# EAGLE schematic DAWA-MAIN-7.0 (EAGLE 9.5.0)
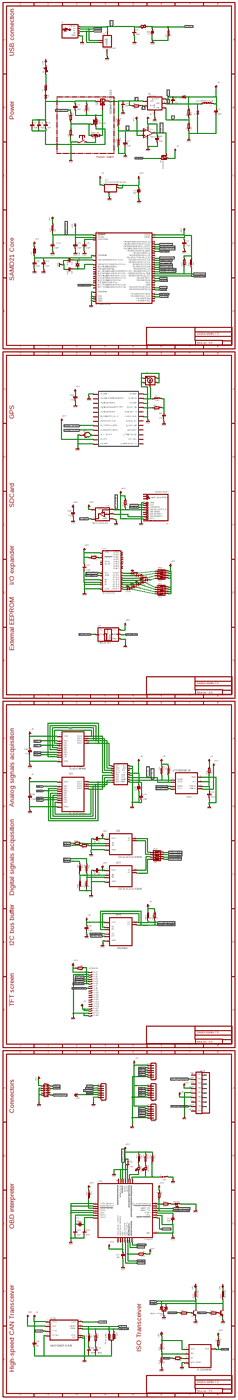
[diagram p0: schematic, sheet 1, overview]
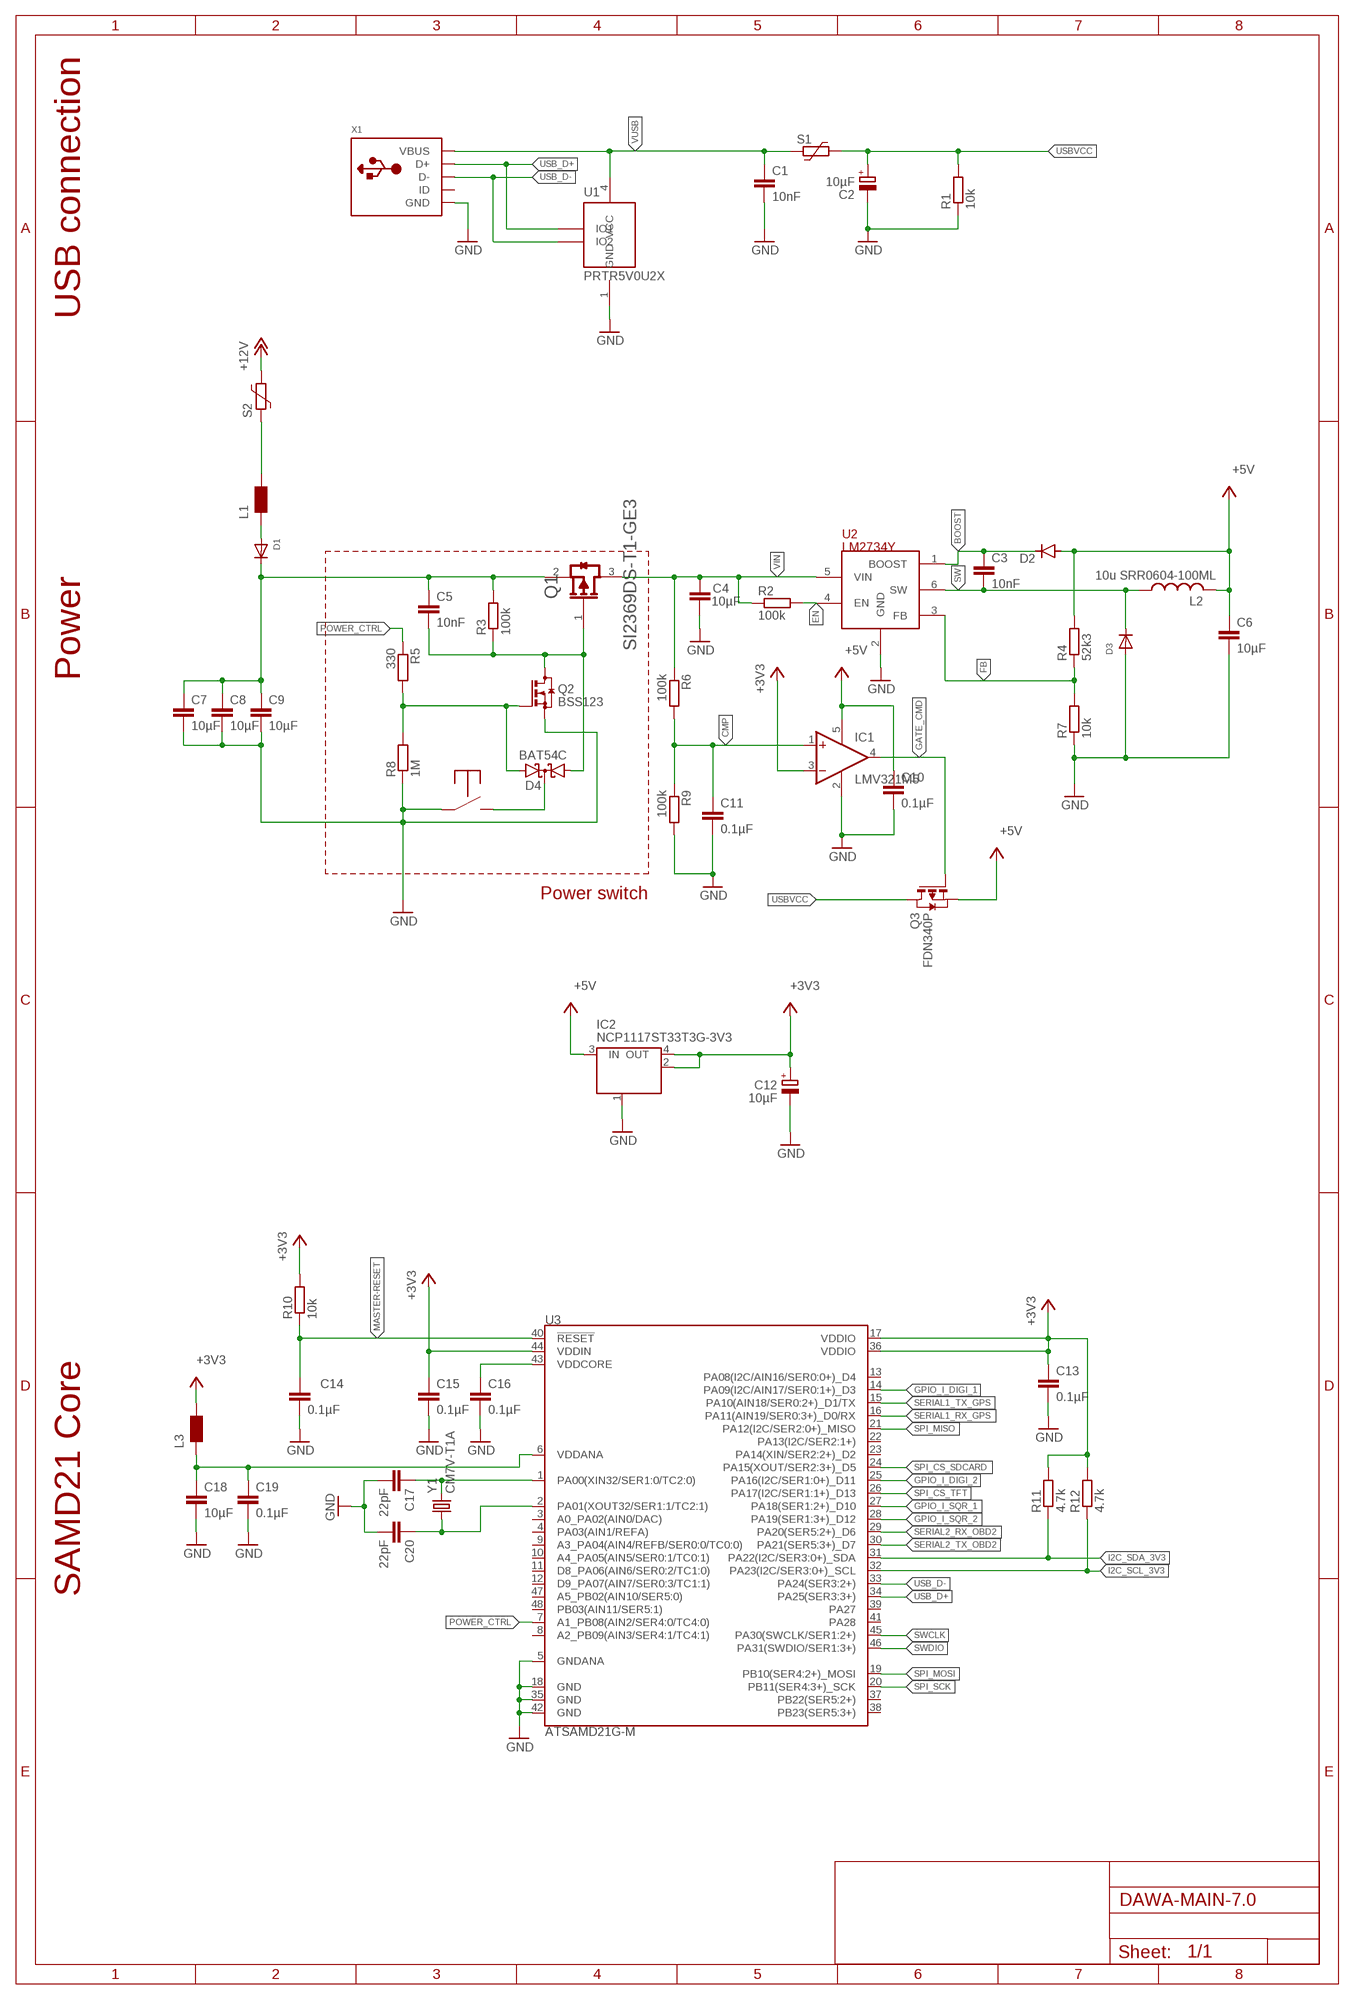
[diagram p1: schematic, sheet 1, part 1 of 4]
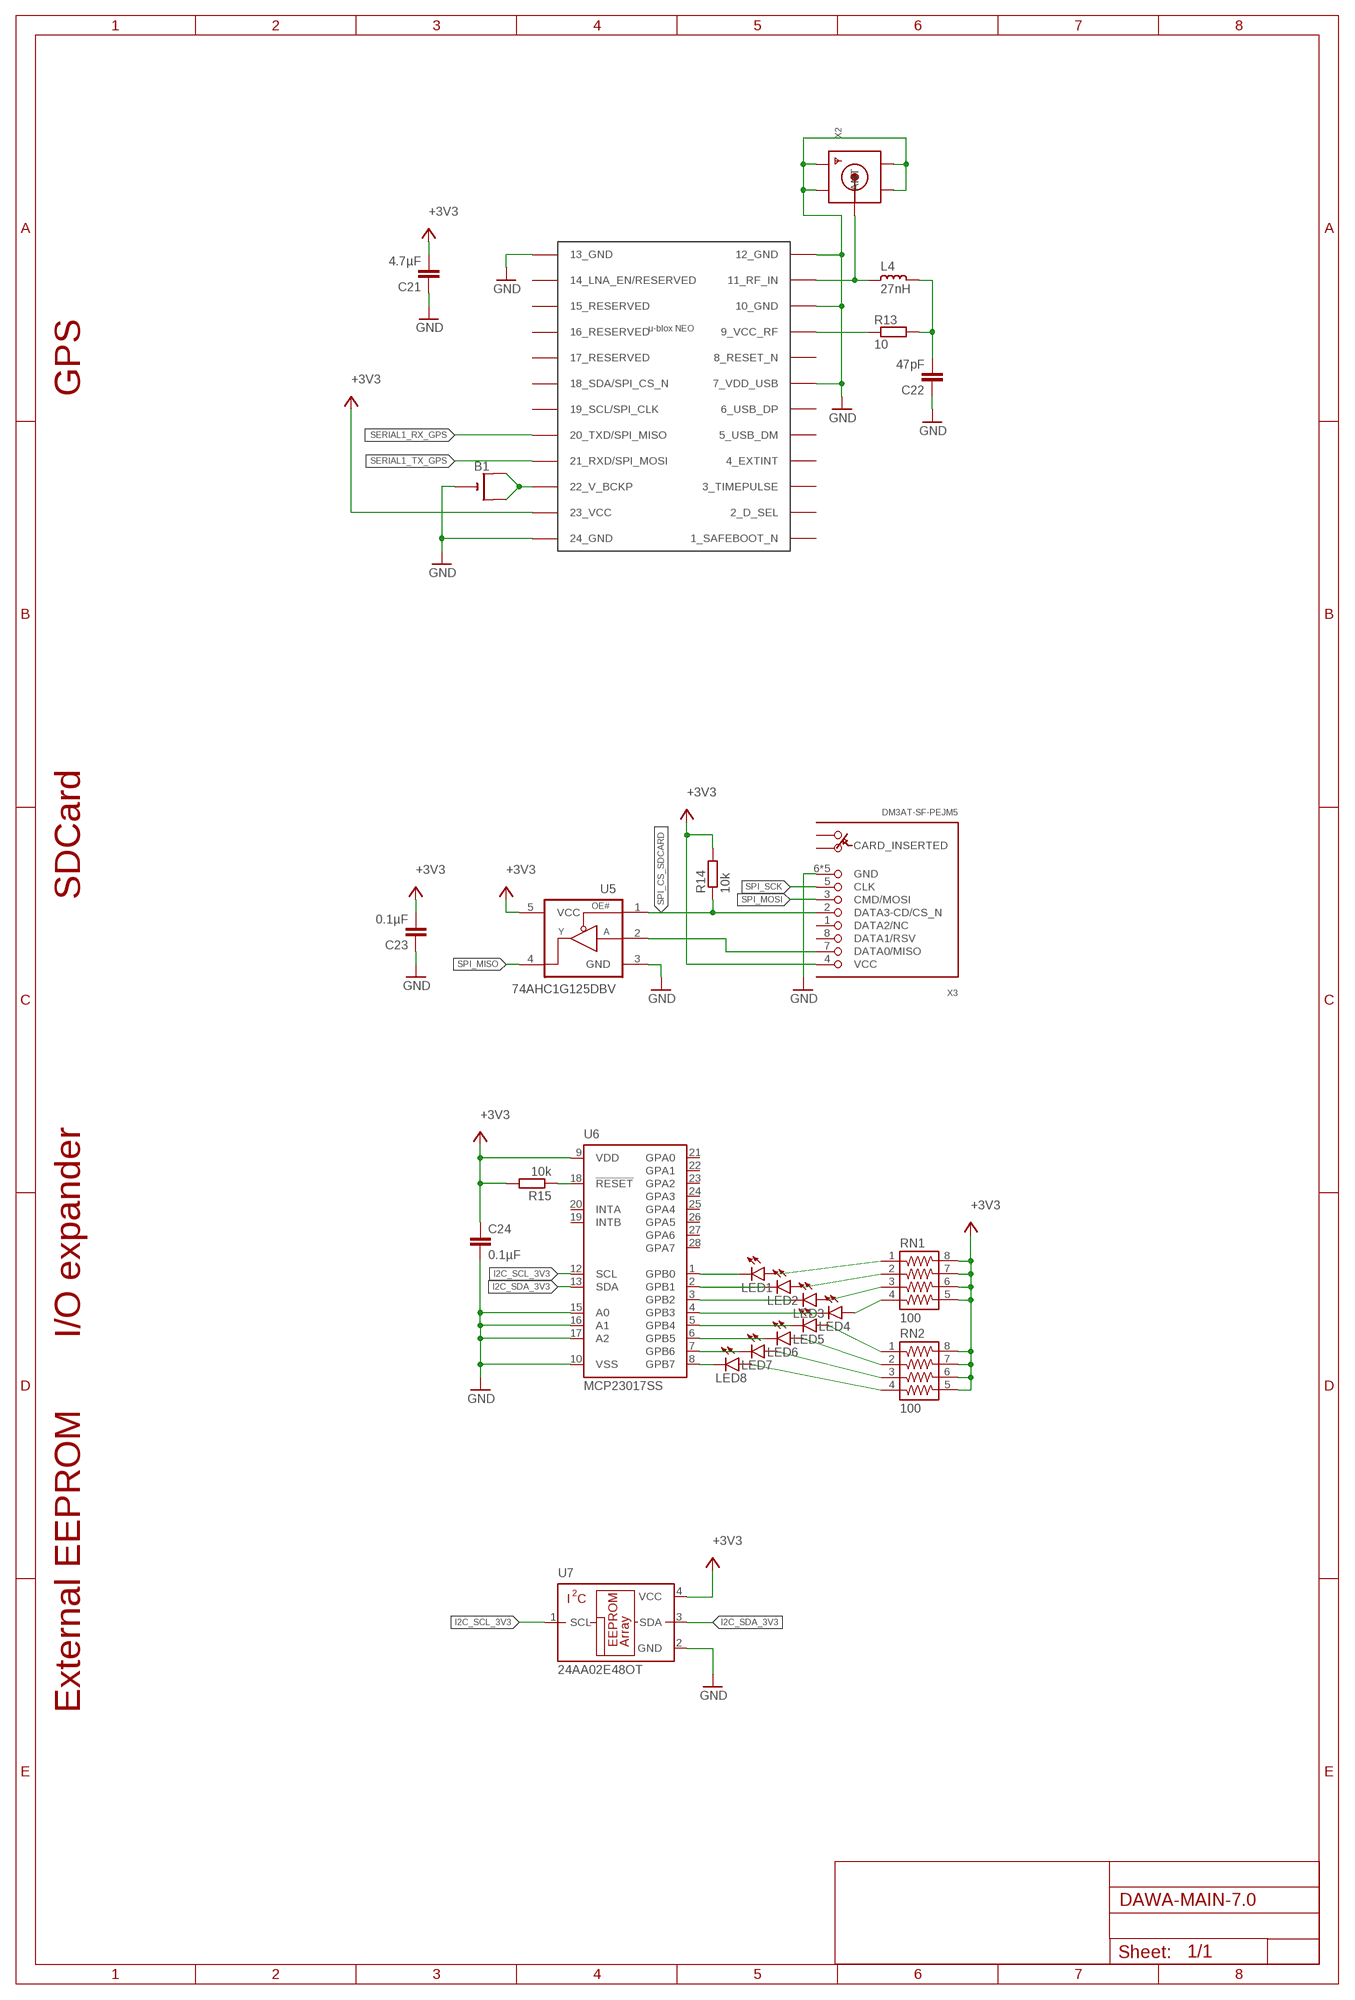
[diagram p2: schematic, sheet 1, part 2 of 4]
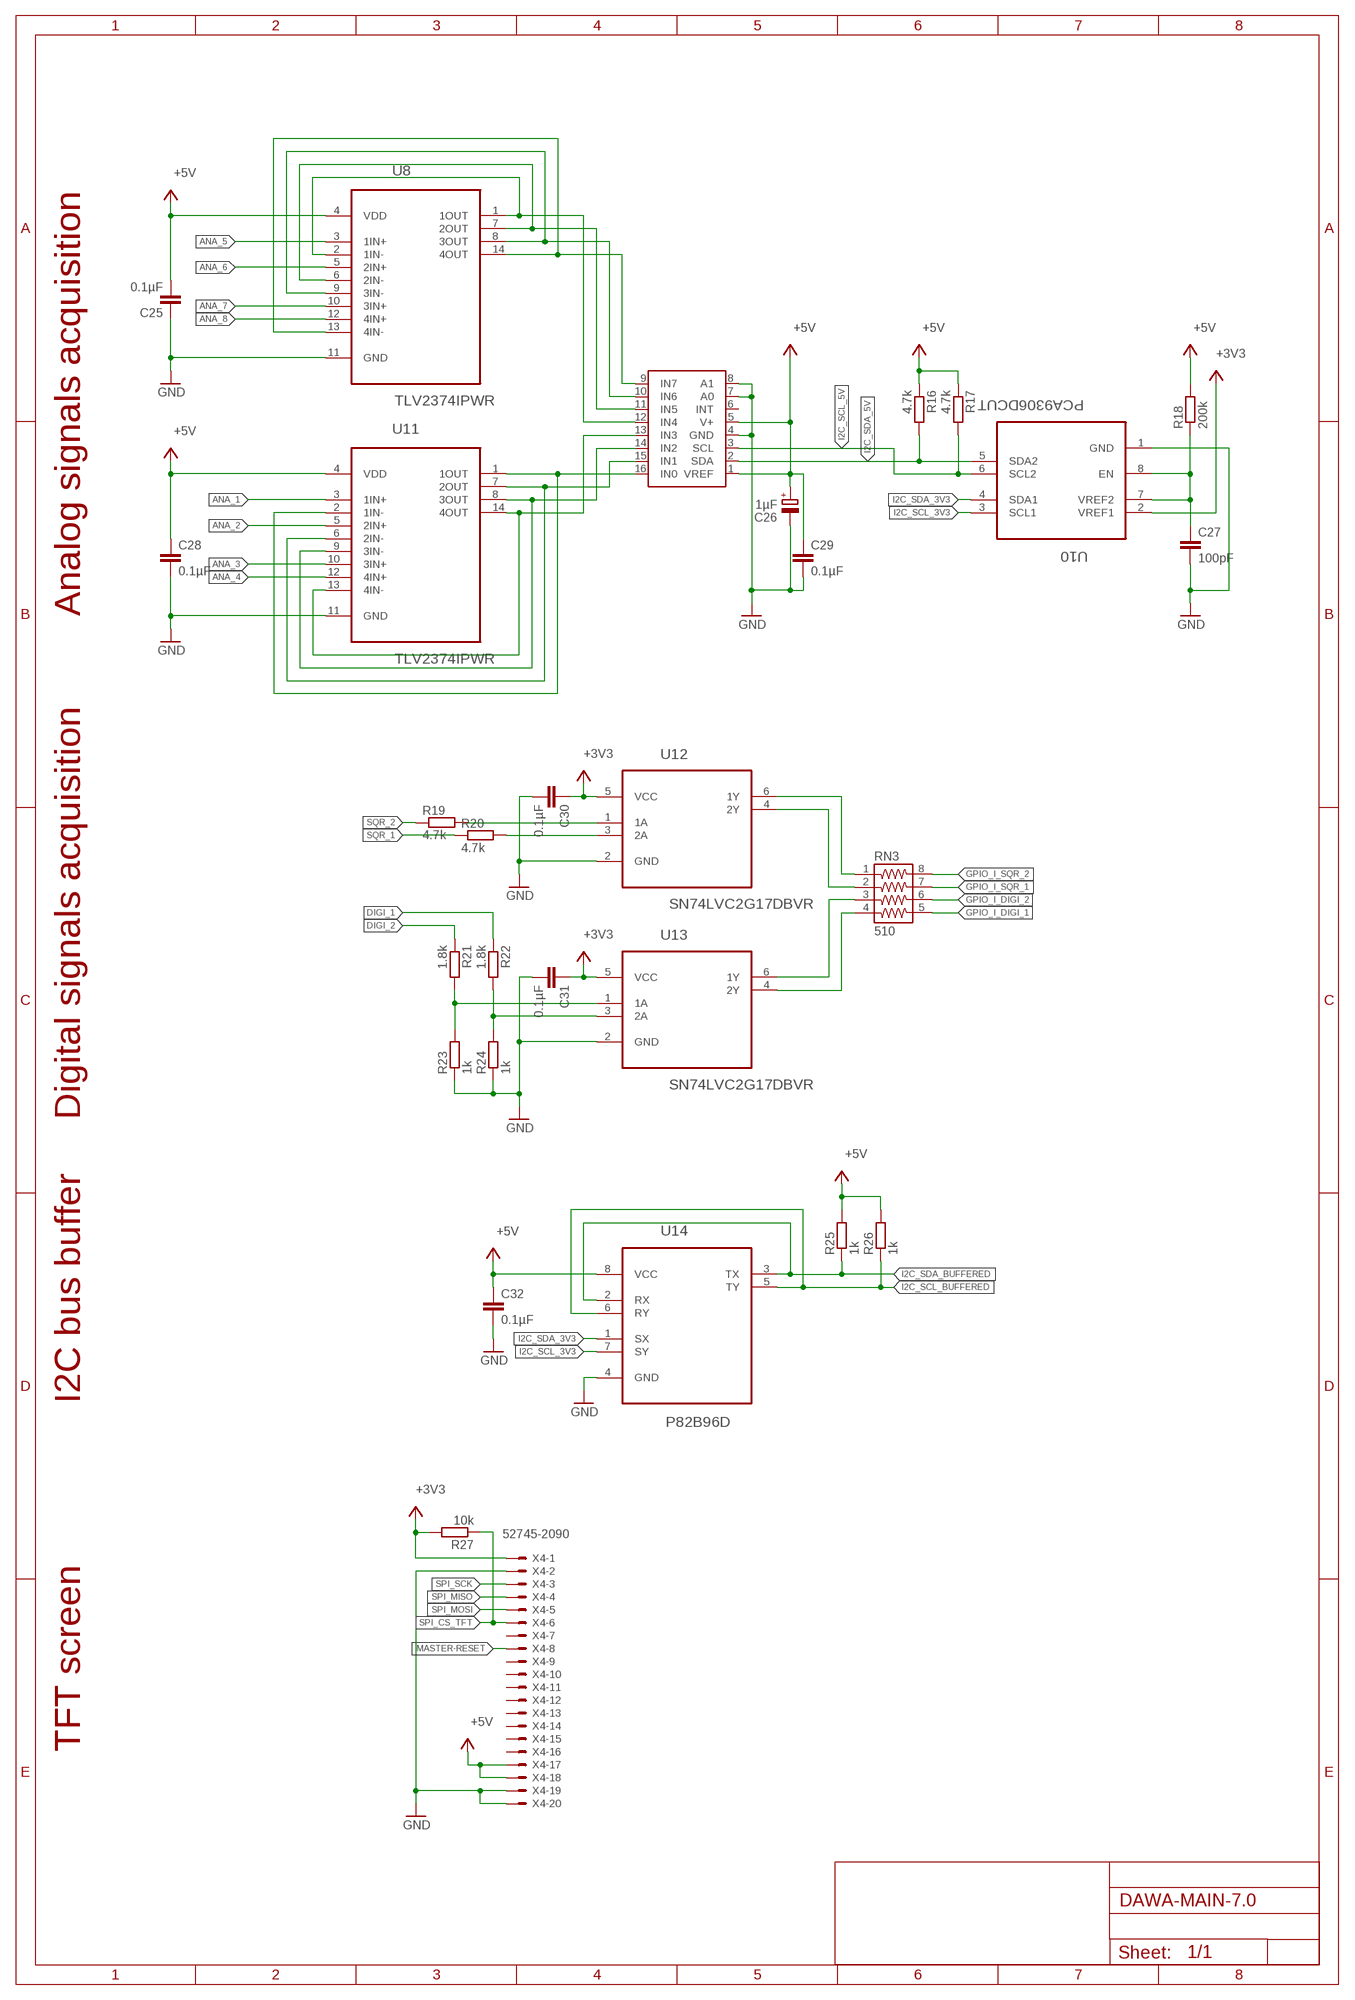
[diagram p3: schematic, sheet 1, part 3 of 4]
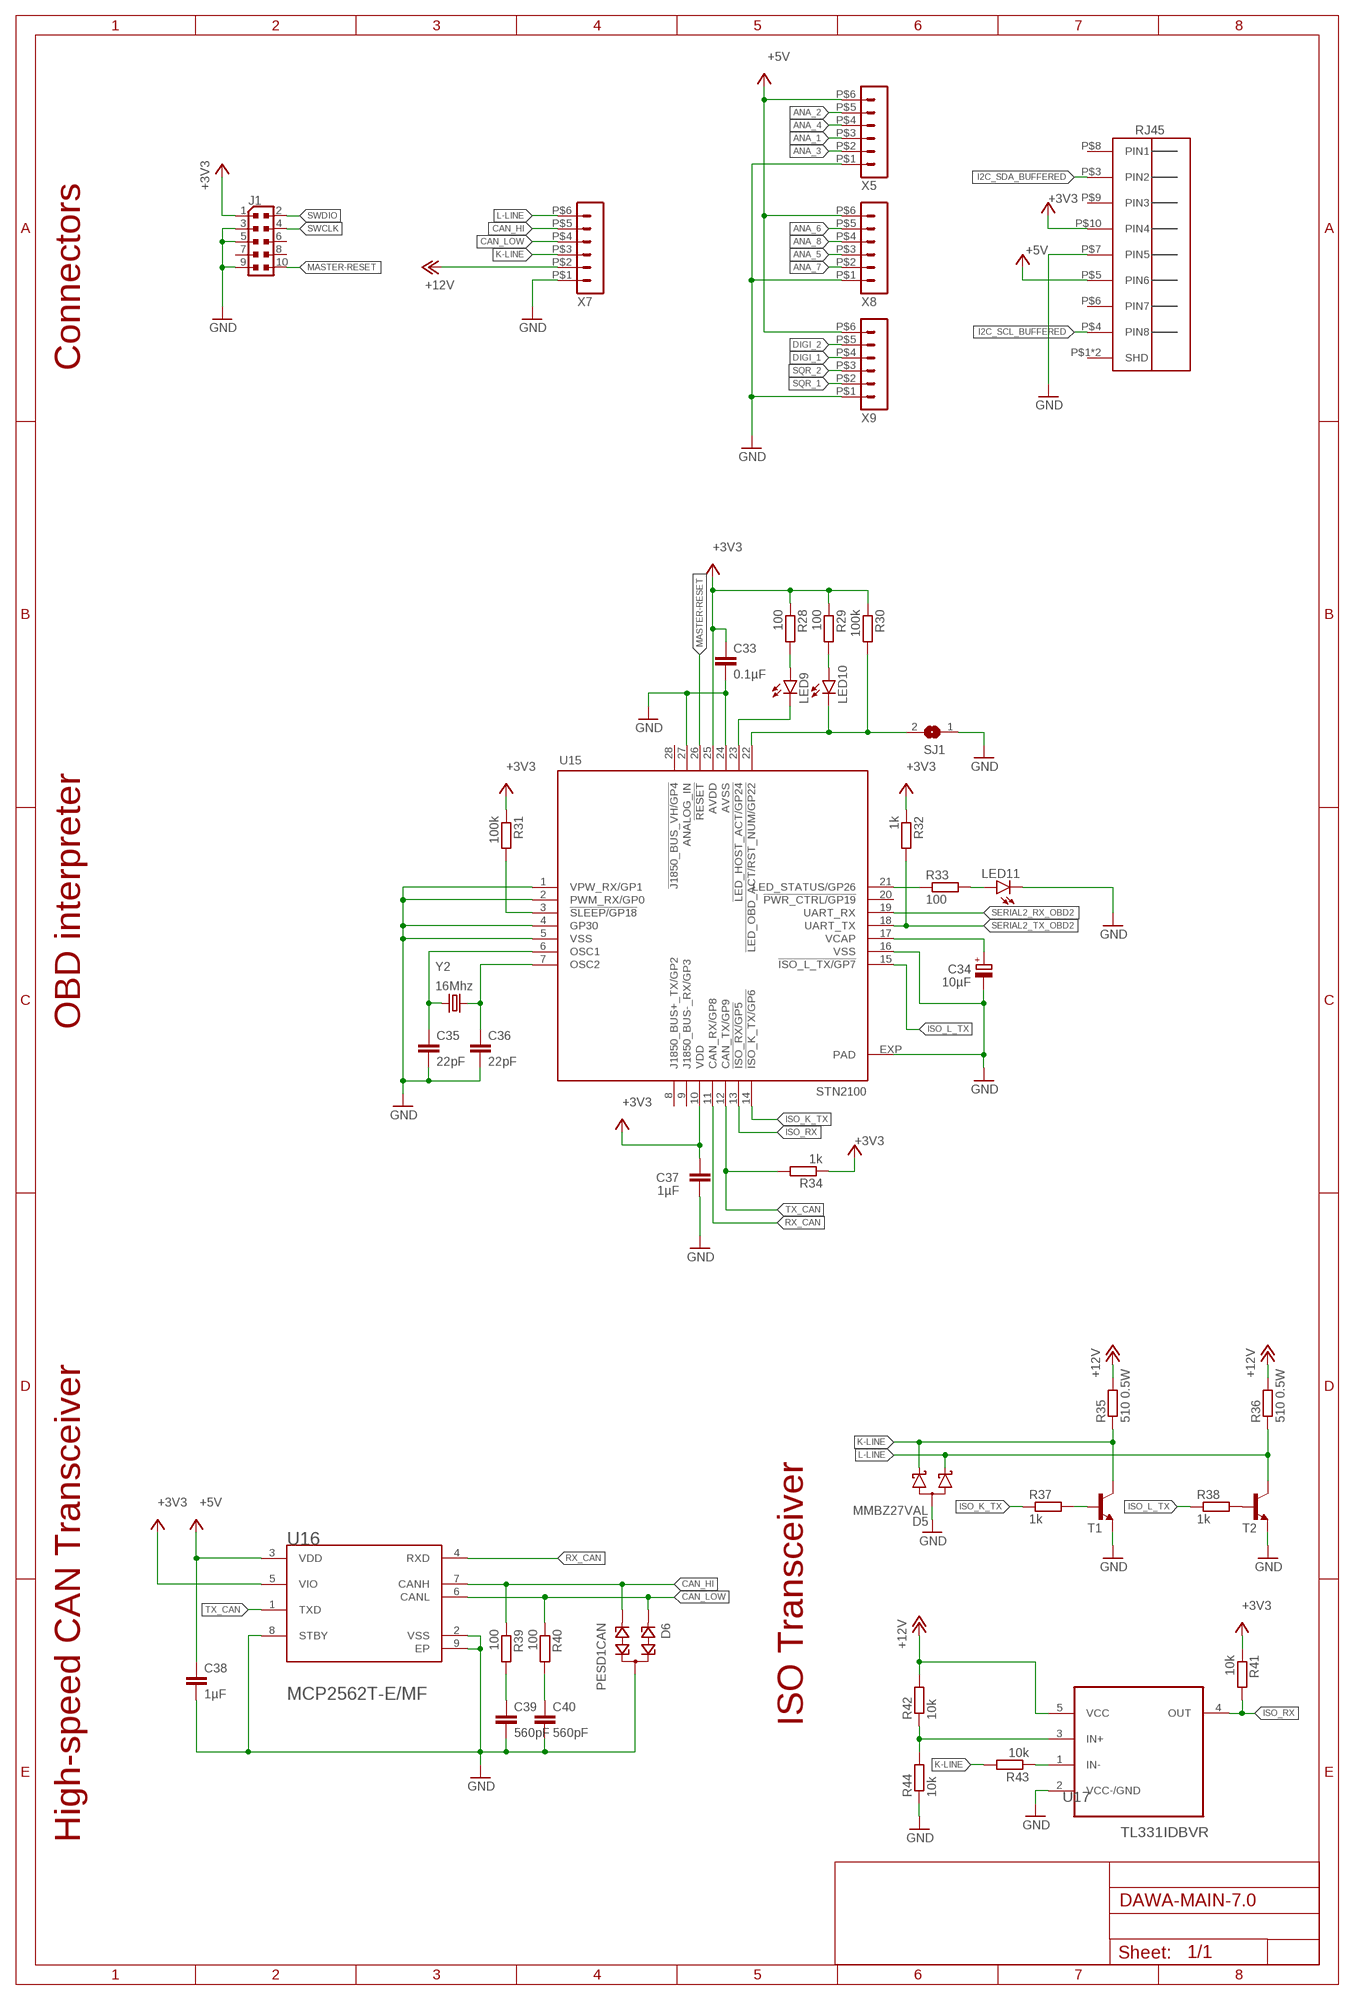
[diagram p4: schematic, sheet 1, part 4 of 4]

## Parts
B1  CR1220SMT  [CR1220-SMD]
C1  10nF  C-EU-10NF-C0603  [C0603]
C2  10µF  CPOL-EU-10UF-SMCB  [SMC_B]
C3  10nF  C-EU-10NF-C0603  [C0603]
C4  10µF  C-EU-10UF-C0805  [C0805]
C5  10nF  C-EU-10NF-C0603  [C0603]
C6  10µF  C-EU-10UF-C0805  [C0805]
C7  10µF  C-EU-10UF-C0805  [C0805]
C8  10µF  C-EU-10UF-C0805  [C0805]
C9  10µF  C-EU-10UF-C0805  [C0805]
C10  0.1µF  C-EU-0.1UF-C0603  [C0603]
C11  0.1µF  C-EU-0.1UF-C0603  [C0603]
C12  10µF  CPOL-EU-10UF-SMCB  [SMC_B]
C13  0.1µF  C-EU-0.1UF-C0603  [C0603]
C14  0.1µF  C-EU-0.1UF-C0603  [C0603]
C15  0.1µF  C-EU-0.1UF-C0603  [C0603]
C16  0.1µF  C-EU-0.1UF-C0603  [C0603]
C17  22pF  C-EU-22PF-C0603  [C0603]
C18  10µF  C-EU-10UF-C0805  [C0805]
C19  0.1µF  C-EU-0.1UF-C0603  [C0603]
C20  22pF  C-EU-22PF-C0603  [C0603]
C21  4.7µF  C-EU-4.7UF-C0603  [C0603]
C22  47pF  C-EU-47PF-C0603  [C0603]
C23  0.1µF  C-EU-0.1UF-C0603  [C0603]
C24  0.1µF  C-EU-0.1UF-C0603  [C0603]
C25  0.1µF  C-EU-0.1UF-C0603  [C0603]
C26  1µF  CPOL-EU-1UF-SMCB  [SMC_B]
C27  100pF  C-EU-100PF-C0603  [C0603]
C28  0.1µF  C-EU-0.1UF-C0603  [C0603]
C29  0.1µF  C-EU-0.1UF-C0603  [C0603]
C30  0.1µF  C-EU-0.1UF-C0603  [C0603]
C31  0.1µF  C-EU-0.1UF-C0603  [C0603]
C32  0.1µF  C-EU-0.1UF-C0603  [C0603]
C33  0.1µF  C-EU-0.1UF-C0603  [C0603]
C34  10µF  CPOL-EU-10UF-SMCB  [SMC_B]
C35  22pF  C-EU-22PF-C0603  [C0603]
C36  22pF  C-EU-22PF-C0603  [C0603]
C37  1µF  C-EU-1UF-C0603  [C0603]
C38  1µF  C-EU-1UF-C0603  [C0603]
C39  560pF  C-EU-560PF-C0603  [C0603]
C40  560pF  C-EU-560PF-C0603  [C0603]
D1  MBR120_SOD-123FL  [SOD-123FL]
D2  CD1206-S01575MINIMELF  [MINIMELF]
D3  MBR120_SOD-123FL  [SOD-123FL]
D4  BAT54C  [SOT23]
D5  MMBZ27VAL  [SOT23]
D6  PESD1CAN  [SOT23]
IC1  LMV321M5  [SOT23-5]
IC2  NCP1117ST33T3G-3V3  MC33269ST  [SOT223]
J1  PINHD-2X5PASSO127  [ARDUINO_WIFI_SHIELD_V018_TG_PINHEAD_2X05_127]
L1  MH2029-300Y_0805  [WUERTH-ELEKTRONIK_0805]
L2  10u SRR0604-100ML  SMARTPRJ_L-USSRR0604  [SRR0604]
L3  MH2029-300Y_0805  [WUERTH-ELEKTRONIK_0805]
L4  27nH  RC-MASTER-SMD_L_0603  [RC-MASTER-SMD_L0603]
LED1  LEDCHIPLED_0603  [CHIPLED_0603]
LED2  LEDCHIPLED_0603  [CHIPLED_0603]
LED3  LEDCHIPLED_0603  [CHIPLED_0603]
LED4  LEDCHIPLED_0603  [CHIPLED_0603]
LED5  LEDCHIPLED_0603  [CHIPLED_0603]
LED6  LEDCHIPLED_0603  [CHIPLED_0603]
LED7  LEDCHIPLED_0603  [CHIPLED_0603]
LED8  LEDCHIPLED_0603  [CHIPLED_0603]
LED9  LEDCHIPLED_0603  [CHIPLED_0603]
LED10  LEDCHIPLED_0603  [CHIPLED_0603]
LED11  LEDCHIPLED_0603  [CHIPLED_0603]
Q1  SI2369DS-T1-GE3VISHAY_SI2369DS-T1-GE3_0_0  [VISHAY_SI2369DS-T1-GE3_0]
Q2  BSS123  [SOT23]
Q3  FDN340P  [SOT-23]
R1  10k  R-EU-10KOHM-R0603  [R0603]
R2  100k  R-EU-100KOHM-R0603  [R0603]
R3  100k  R-EU-100KOHM-R0603  [R0603]
R4  52k3  R-EU-52.3KOHM-R0603  [R0603]
R5  330  R-EU-330OHM-R0603  [R0603]
R6  100k  R-EU-100KOHM-R0603  [R0603]
R7  10k  R-EU-10KOHM-R0603  [R0603]
R8  1M  R-EU-1MOHM-R0603  [R0603]
R9  100k  R-EU-100KOHM-R0603  [R0603]
R10  10k  R-EU-10KOHM-R0603  [R0603]
R11  4.7k  R-EU-4.7KOHM-R0603  [R0603]
R12  4.7k  R-EU-4.7KOHM-R0603  [R0603]
R13  10  R-EU-10OHM-R0603  [R0603]
R14  10k  R-EU-10KOHM-R0603  [R0603]
R15  10k  R-EU-10KOHM-R0603  [R0603]
R16  4.7k  R-EU-4.7KOHM-R0603  [R0603]
R17  4.7k  R-EU-4.7KOHM-R0603  [R0603]
R18  200k  R-EU-200KOHM-R0603  [R0603]
R19  4.7k  R-EU-4.7KOHM-R0603  [R0603]
R20  4.7k  R-EU-4.7KOHM-R0603  [R0603]
R21  1.8k  R-EU-1.8KOHM-R0603  [R0603]
R22  1.8k  R-EU-1.8KOHM-R0603  [R0603]
R23  1k  R-EU-1KOHM-R0603  [R0603]
R24  1k  R-EU-1KOHM-R0603  [R0603]
R25  1k  R-EU-1KOHM-R0603  [R0603]
R26  1k  R-EU-1KOHM-R0603  [R0603]
R27  10k  R-EU-10KOHM-R0603  [R0603]
R28  100  R-EU-100OHM-R0603  [R0603]
R29  100  R-EU-100OHM-R0603  [R0603]
R30  100k  R-EU-100KOHM-R0603  [R0603]
R31  100k  R-EU-100KOHM-R0603  [R0603]
R32  1k  R-EU-1KOHM-R0603  [R0603]
R33  100  R-EU-100OHM-R0603  [R0603]
R34  1k  R-EU-1KOHM-R0603  [R0603]
R35  510 0.5W  R-EU-510OHM-R0603  [R0603]
R36  510 0.5W  R-EU-510OHM-R0603  [R0603]
R37  1k  R-EU-1KOHM-R0603  [R0603]
R38  1k  R-EU-1KOHM-R0603  [R0603]
R39  100  R-EU-100OHM-R0603  [R0603]
R40  100  R-EU-100OHM-R0603  [R0603]
R41  10k  R-EU-10KOHM-R0603  [R0603]
R42  10k  R-EU-10KOHM-R0603  [R0603]
R43  10k  R-EU-10KOHM-R0603  [R0603]
R44  10k  R-EU-10KOHM-R0603  [R0603]
RN1  100  742-8-4X100OHMNS  [742-8NS]
RN2  100  742-8-4X100OHMNS  [742-8NS]
RN3  510  742-8-4X510OHMNS  [742-8NS]
S1  MF-NSMF050-1206  [MF-1206]
S2  MF-MSMF050-1812  [MF-1812]
S3  SKPMAPE10  [SKPMAPE10]
SJ1  SJ  [SJ]
T1  MMBT2222ALT1-NPN-SOT23-BEC  [SOT23-BEC]
T2  MMBT2222ALT1-NPN-SOT23-BEC  [SOT23-BEC]
U1  PRTR5V0U2X  [SOT-143B]
U2  LM2734Y  [SOT23-6]
U3  ATSAMD21G-M  [QFN-48]
U4  NEO-M8  [NEO-M8]
U5  74AHC1G125DBV  [SOT23-5]
U6  MCP23017SS  [SSOP28]
U7  24AA02E48OT  [SOT23-5]
U8  TLV2374IPWR  [SOP65P640X120-14N]
U9  ADC128D818  [ADC12_SD]
U10  PCA9306DCUT  [SOP50P310X90-8N]
U11  TLV2374IPWR  [SOP65P640X120-14N]
U12  SN74LVC2G17DBVR  [SOT95P280X145-6N]
U13  SN74LVC2G17DBVR  [SOT95P280X145-6N]
U14  P82B96D  [SOIC127P600X175-8N]
U15  STN2100  [QFN-28-S]
U16  MCP2562T-E-MFMICROCHIP_MCP2562T-E-MF_0_2  [MICROCHIP_MCP2562T-E-MF_2]
U17  TL331IDBVR  [SOT95P280X145-5N]
X1  USB  [USB-MINIB-DAWA]
X2  SMACONNECTOR_EDGE  [SMA_EDGELAUNCH]
X3  DM3AT-SF-PEJM5  [DM3AT-SF-PEJM5]
X4  52745-2090  [52745-2090]
X5  HEADER_POS6_43045-0600  [43045-0600]
X6  RJ45  [RJ45]
X7  HEADER_POS6_43045-0600  [43045-0600]
X8  HEADER_POS6_43045-0600  [43045-0600]
X9  HEADER_POS6_43045-0600  [43045-0600]
Y1  CM7V-T1A  [KANFLO_OSCILLATOR_SMD]
Y2  16Mhz  KX-7  [3.2X2.5_KX-7]

## Nets
+3V3: C12.+ C13.1 C15.1 C21.2 C23.2 C24.1 C30.1 C31.1 C33.1 C37.1 IC1.3(-IN) IC2.2(OUT) IC2.4(OUT) J1.1 L3.2 R10.2 R11.2 R12.2 R14.2 R15.2 R27.2 R28.1 R29.1 R30.1 R31.1 R32.1 R34.1 R41.1 RN1.5 RN1.6 RN1.7 RN1.8 RN2.5 RN2.6 RN2.7 RN2.8 U3.17(VDDIO) U3.36(VDDIO) U3.44(VDDIN) U4.23(23_VCC) U5.5(VCC) U6.9(VDD) U7.4(VCC) U10.2(VREF1) U12.5(VCC) U13.5(VCC) U15.10(VDD) U15.25(AVDD) U16.5(VIO) X3.4(VCC) X4.1 X6.P$10(PIN4)
+5V: C6.1 C10.1 C25.2 C26.+ C28.1 C29.1 C32.1 C38.1 D2.A IC1.5(V+) IC2.3(IN) L2.P$2 Q3.2(S) R4.2 R16.1 R17.1 R18.2 R25.2 R26.2 U8.4(VDD) U9.1(VREF) U9.5(V+) U11.4(VDD) U14.8(VCC) U16.3(VDD) X4.17 X4.18 X5.P$6 X6.P$5(PIN6) X8.P$6 X9.P$6
+12V: R35.2 R36.2 R42.2 S2.1 U17.5(VCC) X7.P$2
ANA_1: U11.3(1IN+) X5.P$3
ANA_2: U11.5(2IN+) X5.P$5
ANA_3: U11.10(3IN+) X5.P$2
ANA_4: U11.12(4IN+) X5.P$4
ANA_5: U8.3(1IN+) X8.P$3
ANA_6: U8.5(2IN+) X8.P$5
ANA_7: U8.10(3IN+) X8.P$2
ANA_8: U8.12(4IN+) X8.P$4
BOOST: C3.1 D2.C U2.1(BOOST)
CAN_HI: D6.2 R39.1 U16.7(CANH) X7.P$5
CAN_LOW: D6.1 R40.1 U16.6(CANL) X7.P$4
CMP: C11.1 IC1.1(+IN) R6.2 R9.1
DIGI_1: R22.1 X9.P$4
DIGI_2: R21.1 X9.P$5
EN: R2.2 U2.4(EN)
FB: R4.1 R7.2 U2.3(FB)
GATE_CMD: IC1.4(OUT) Q3.3(G)
GND: B1.- C1.2 C2.- C4.2 C6.2 C7.2 C8.2 C9.2 C10.2 C11.2 C12.- C13.2 C14.2 C15.2 C16.2 C17.2 C18.2 C19.2 C20.2 C21.1 C22.1 C23.1 C24.2 C25.1 C26.- C27.2 C28.2 C29.2 C30.2 C31.2 C32.2 C33.2 C34.- C35.2 C36.2 C37.2 C38.2 C39.2 C40.2 D3.A D5.3(A) D6.3 IC1.2(V-) IC2.1(GND/ADJ) J1.3 J1.5 J1.9 LED11.C Q2.2(S) R1.1 R7.1 R8.1 R9.2 R23.1 R24.1 R44.1 S3.P$1 SJ1.1 T1.E T2.E U1.1(GND) U2.2(GND) U3.5(GNDANA) U3.18(GND) U3.35(GND) U3.42(GND) U4.7(7_VDD_USB) U4.10(10_GND) U4.12(12_GND) U4.13(13_GND) U4.24(24_GND) U5.3(GND) U6.10(VSS) U6.15(A0) U6.16(A1) U6.17(A2) U7.2(GND) U8.11(GND) U9.4(GND) U9.7(A0) U9.8(A1) U10.1(GND) U11.11(GND) U12.2(GND) U13.2(GND) U14.4(GND) U15.1(VPW_RX/GP1) U15.2(PWM_RX/GP0) U15.4(GP30) U15.5(VSS) U15.16(VSS) U15.24(AVSS) U15.27(ANALOG_IN) U15.EXP(PAD) U16.2(VSS) U16.8(STBY) U16.9(EP) U17.2(VCC-/GND) X1.GND X1.GND1(GND) X1.GND2(GND) X2.GND@1(GND4) X2.GND@2(GND3) X2.GND@3(GND2) X2.GND@4(GND1) X3.6(GND) X3.MOUNT0(GND) X3.MOUNT1(GND) X3.MOUNT2(GND) X3.MOUNT3(GND) X4.2 X4.19 X4.20 X5.P$1 X6.P$7(PIN5) X7.P$1 X8.P$1 X9.P$1
GPIO_I_DIGI_1: RN3.5 U3.14(PA09(I2C/AIN17/SER0:1+)_D3)
GPIO_I_DIGI_2: RN3.6 U3.25(PA16(I2C/SER1:0+)_D11)
GPIO_I_SQR_1: RN3.7 U3.27(PA18(SER1:2+)_D10)
GPIO_I_SQR_2: RN3.8 U3.28(PA19(SER1:3+)_D12)
I2C_SCL_3V3: R12.1 U3.32(PA23(I2C/SER3:0+)_SCL) U6.12(SCL) U7.1(SCL) U10.3(SCL1) U14.7(SY)
I2C_SCL_5V: R17.2 U9.3(SCL) U10.6(SCL2)
I2C_SCL_BUFFERED: R26.1 U14.5(TY) U14.6(RY) X6.P$4(PIN8)
I2C_SDA_3V3: R11.1 U3.31(PA22(I2C/SER3:0+)_SDA) U6.13(SDA) U7.3(SDA) U10.4(SDA1) U14.1(SX)
I2C_SDA_5V: R16.2 U9.2(SDA) U10.5(SDA2)
I2C_SDA_BUFFERED: R25.1 U14.2(RX) U14.3(TX) X6.P$3(PIN2)
ISO_K_TX: R37.1 U15.14(!ISO_K_TX/GP6)
ISO_L_TX: R38.1 U15.15(!ISO_L_TX/GP7)
ISO_RX: R41.2 U15.13(!ISO_RX/GP5) U17.4(OUT)
K-LINE: D5.2(C2) R35.1 R43.2 T1.C X7.P$3
L-LINE: D5.1(C1) R36.1 T2.C X7.P$6
MASTER-RESET: C14.1 J1.10 R10.1 U3.40(!RESET!) U15.26(!RESET) X4.8
N$1: C16.1 U3.43(VDDCORE)
N$2: C17.1 U3.1(PA00(XIN32/SER1:0/TC2:0)) Y1.2
N$3: C20.1 U3.2(PA01(XOUT32/SER1:1/TC2:1)) Y1.1
N$5: LED1.C U6.1(GPB0)
N$6: B1.+$1(+) B1.+$2(+1) U4.22(22_V_BCKP)
N$7: LED2.C U6.2(GPB1)
N$8: C5.1 C7.1 C8.1 C9.1 D1.C Q1.2(S) R3.2
N$9: LED1.A RN1.1
N$10: D1.A L1.1
N$11: C22.2 L4.1 R13.2
N$12: LED2.A RN1.2
N$13: U5.2(A) X3.7(DATA0/MISO)
N$14: LED5.C U6.5(GPB4)
N$15: C27.1 R18.1 U10.7(VREF2) U10.8(EN)
N$16: LED6.C U6.6(GPB5)
N$17: LED7.C U6.7(GPB6)
N$18: LED8.C U6.8(GPB7)
N$19: R13.1 U4.9(9_VCC_RF)
N$20: L4.2 U4.11(11_RF_IN) X2.P(ANT)
N$21: LED3.A RN1.3
N$22: LED3.C U6.3(GPB2)
N$23: LED4.C U6.4(GPB3)
N$24: LED4.A RN1.4
N$25: LED5.A RN2.1
N$26: LED6.A RN2.2
N$27: U9.16(IN0) U11.1(1OUT) U11.2(1IN-)
N$28: U9.15(IN1) U11.6(2IN-) U11.7(2OUT)
N$29: LED7.A RN2.3
N$30: LED8.A RN2.4
N$31: U9.14(IN2) U11.8(3OUT) U11.9(3IN-)
N$32: LED10.C R30.2 SJ1.2 U15.22(!LED_OBD_ACT/RST_NUM/GP22)
N$33: R37.2 T1.B
N$34: R15.1 U6.18(!RESET)
N$35: U9.13(IN3) U11.13(4IN-) U11.14(4OUT)
N$36: RN3.1 U12.6(1Y)
N$37: L1.2 S2.2
N$38: U8.8(3OUT) U8.9(3IN-) U9.10(IN6)
N$39: U8.6(2IN-) U8.7(2OUT) U9.11(IN5)
N$40: U8.1(1OUT) U8.2(1IN-) U9.12(IN4)
N$41: R19.2 U12.1(1A)
N$42: R20.2 U12.3(2A)
N$43: R22.2 R24.2 U13.3(2A)
N$44: R21.2 R23.2 U13.1(1A)
N$45: RN3.3 U13.6(1Y)
N$46: RN3.4 U13.4(2Y)
N$47: C5.2 D4.1(A1) Q1.1(G) Q2.3(D) R3.1
N$48: D4.3(CC) S3.P$2
N$49: RN3.2 U12.4(2Y)
N$50: D4.2(A2) Q2.1(G) R5.2 R8.2
N$51: U8.13(4IN-) U8.14(4OUT) U9.9(IN7)
N$52: R38.2 T2.B
N$53: R42.1 R44.2 U17.3(IN+)
N$54: R43.1 U17.1(IN-)
N$56: R31.2 U15.3(!SLEEP/GP18)
N$57: C35.1 U15.6(OSC1) Y2.1
N$58: C36.1 U15.7(OSC2) Y2.3
N$60: LED9.A R28.2
N$61: C34.+ U15.17(VCAP)
N$62: R33.1 U15.21(LED_STATUS/GP26)
N$63: LED11.A R33.2
N$64: LED10.A R29.2
N$66: LED9.C U15.23(!LED_HOST_ACT/GP24)
N$67: C39.1 R39.2
N$68: C40.1 R40.2
POWER_CTRL: R5.1 U3.7(A1_PB08(AIN2/SER4:0/TC4:0))
RX_CAN: U15.11(CAN_RX/GP8) U16.4(RXD)
SERIAL1_RX_GPS: U3.16(PA11(AIN19/SER0:3+)_D0/RX) U4.20(20_TXD/SPI_MISO)
SERIAL1_TX_GPS: U3.15(PA10(AIN18/SER0:2+)_D1/TX) U4.21(21_RXD/SPI_MOSI)
SERIAL2_RX_OBD2: U3.29(PA20(SER5:2+)_D6) U15.19(UART_RX)
SERIAL2_TX_OBD2: R32.2 U3.30(PA21(SER5:3+)_D7) U15.18(UART_TX)
SPI_CS_SDCARD: R14.1 U3.24(PA15(XOUT/SER2:3+)_D5) U5.1(OE#) X3.2(DATA3-CD/CS_N)
SPI_CS_TFT: R27.1 U3.26(PA17(I2C/SER1:1+)_D13) X4.6
SPI_MISO: U3.21(PA12(I2C/SER2:0+)_MISO) U5.4(Y) X4.4
SPI_MOSI: U3.19(PB10(SER4:2+)_MOSI) X3.3(CMD/MOSI) X4.5
SPI_SCK: U3.20(PB11(SER4:3+)_SCK) X3.5(CLK) X4.3
SQR_1: R20.1 X9.P$2
SQR_2: R19.1 X9.P$3
SW: C3.2 D3.C L2.P$1 U2.6(SW)
SWCLK: J1.4 U3.45(PA30(SWCLK/SER1:2+))
SWDIO: J1.2 U3.46(PA31(SWDIO/SER1:3+))
TX_CAN: R34.2 U15.12(CAN_TX/GP9) U16.1(TXD)
USB_D+: U1.2(IO1) U3.34(PA25(SER3:3+)) X1.D+
USB_D-: U1.3(IO2) U3.33(PA24(SER3:2+)) X1.D-
USBVCC: C2.+ Q3.1(D) R1.2 S1.2
VDDANA: C18.1 C19.1 L3.1 U3.6(VDDANA)
VIN: C4.1 Q1.3(D) R2.1 R6.1 U2.5(VIN)
VUSB [usbvcc]: C1.1 S1.1 U1.4(VCC) X1.VBUS
Unconnected: J1.6 J1.7 J1.8 U3.3(A0_PA02(AIN0/DAC)) U3.4(PA03(AIN1/REFA)) U3.8(A2_PB09(AIN3/SER4:1/TC4:1)) U3.9(A3_PA04(AIN4/REFB/SER0:0/TC0:0)) U3.10(A4_PA05(AIN5/SER0:1/TC0:1)) U3.11(D8_PA06(AIN6/SER0:2/TC1:0)) U3.12(D9_PA07(AIN7/SER0:3/TC1:1)) U3.13(PA08(I2C/AIN16/SER0:0+)_D4) U3.22(PA13(I2C/SER2:1+)) U3.23(PA14(XIN/SER2:2+)_D2) U3.37(PB22(SER5:2+)) U3.38(PB23(SER5:3+)) U3.39(PA27) U3.41(PA28) U3.47(A5_PB02(AIN10/SER5:0)) U3.48(PB03(AIN11/SER5:1)) U4.1(1_SAFEBOOT_N) U4.2(2_D_SEL) U4.3(3_TIMEPULSE) U4.4(4_EXTINT) U4.5(5_USB_DM) U4.6(6_USB_DP) U4.8(8_RESET_N) U4.14(14_LNA_EN/RESERVED) U4.15(15_RESERVED) U4.16(16_RESERVED) U4.17(17_RESERVED) U4.18(18_SDA/SPI_CS_N) U4.19(19_SCL/SPI_CLK) U6.19(INTB) U6.20(INTA) U6.21(GPA0) U6.22(GPA1) U6.23(GPA2) U6.24(GPA3) U6.25(GPA4) U6.26(GPA5) U6.27(GPA6) U6.28(GPA7) U9.6(INT) U15.8(J1850_BUS+_TX/GP2) U15.9(J1850_BUS-_RX/GP3) U15.20(!PWR_CTRL/GP19) U15.28(!J1850_BUS_VH/GP4) X1.ID X3.1(DATA2/NC) X3.8(DATA1/RSV) X3.A X3.B X4.7 X4.9 X4.10 X4.11 X4.12 X4.13 X4.14 X4.15 X4.16 X6.P$1(SHD) X6.P$2(SHD) X6.P$6(PIN7) X6.P$8(PIN1) X6.P$9(PIN3)

## Notes on the sheet
- USB connection
- Power
- Power switch
- SAMD21 Core
- GPS
- SDCard
- I/O expander
- External EEPROM
- Analog signals acquisition
- Digital signals acquisition
- I2C bus buffer
- TFT screen
- Connectors
- OBD interpreter
- ISO Transceiver
- High-speed CAN Transceiver

## Library data of the parts
B1 = DAWA-MAIN-7.0:CR1220: CR1216/CR1220/CR1225 12mm 3V lithium coin cell Great for battery packup. Both SMT and THM holders. Note the THM package has the ground pads on both sides of the PCB so that the masks are the same - this reduces the cost; MPN: 3000TR
C1 C3 C5 = DAWA-MAIN-7.0:C-EU-*-?: CAPACITOR, European symbol; MPN: C0603C103K3RAC7411
C2 C12 C34 = DAWA-MAIN-7.0:CPOL-EU-*-?: POLARIZED CAPACITOR, European symbol; MPN: TAJB106K025RNJ
C4 C6-C9 C18 = DAWA-MAIN-7.0:C-EU-*-?: CAPACITOR, European symbol; MPN: C0805C106K4PAC7210
C10 C11 C13-C16 C19 C23-C25 C28-C33 = DAWA-MAIN-7.0:C-EU-*-?: CAPACITOR, European symbol; MPN: C0603C104M4RAC7411
C17 C20 C35 C36 = DAWA-MAIN-7.0:C-EU-*-?: CAPACITOR, European symbol; MPN: C0603C220K4GACTU
C21 = DAWA-MAIN-7.0:C-EU-*-?: CAPACITOR, European symbol; MPN: C0603C475K9PAC7411
C22 = DAWA-MAIN-7.0:C-EU-*-?: CAPACITOR, European symbol; MPN: C0603C470G3HACTU
C26 = DAWA-MAIN-7.0:CPOL-EU-*-?: POLARIZED CAPACITOR, European symbol; MPN: TAJT105K016RNJ
C27 = DAWA-MAIN-7.0:C-EU-*-?: CAPACITOR, European symbol; MPN: C0603C101K5GACTU
C37 C38 = DAWA-MAIN-7.0:C-EU-*-?: CAPACITOR, European symbol; MPN: C0603C105K4RAC7411
C39 C40 = DAWA-MAIN-7.0:C-EU-*-?: CAPACITOR, European symbol; MPN: C0603C561J5GACTU
D1 D3 = DAWA-MAIN-7.0:MBR120: Diode SMADIODE - SMA Surface Mount Package 20V 1A Schottky Diode Digikey: 641-1014-6-ND DO-1N4148 - Through Hole Small Current Diode SOD-123 20V 1 A (.5mV Vf) Schottky Diode - Digikey: MBRX120TPMSCT-ND SOD-323 10V 570mA (.38mV Vf, 3ns) Schottky Diode - Digikey: ZLLS410CT-ND SOD-523 30V 30mA Schottky Diode (RB751S-40TE61) - Digikey: RB751S-40TE61CT-ND SOT23-R/W - SOT23 Package (R = Solder Paste/Reflow Ovens, W = Hand-Soldering) BAT54Film 40V 300mA - Digikey: 497-7162-1-ND; MPN: MBR120ESFT3G; URL_ALIEXPRESS: https://fr.aliexpress.com/item/32658704895.html
D2 = DAWA-MAIN-7.0:CD1206-S01575: DIODE; MPN: CD1206-S01575
D4 = DAWA-MAIN-7.0:BAT54C: Schottky Diodes Source: Fairchild .. BAT54.pdf; MPN: BAT54C,215
D5 = DAWA-MAIN-7.0:MMBZ27VAL: Dual Common Anode Zeners; MPN: MMBZ27VALT3G
D6 = DAWA-MAIN-7.0:PESD1CAN: CAN bus ESD protection diode Source: http://www.nxp.com/documents/data_sheet/PESD1CAN.pdf; MPN: PESD1CAN,215
IC1 = DAWA-MAIN-7.0:LMV321?*: General Purpose, Low Voltage, Rail-to-Rail Output Operational Amplifiers Source: http://www.national.com/mpf/LM/LMV321.html http://www.national.com/dt/lmv_qual.pdf; MPN: LMV321M5X/NOPB
IC2 = DAWA-MAIN-7.0:MC33269ST*: Adjustable Output Low Dropout Voltage Regulator 800 mA Source: http://www.onsemi.com/pub/Collateral/MC33269-D.PDF; MPN: MC33269ST-3.3T3G; URL_ALIEXPRESS: https://fr.aliexpress.com/item/32987702593.html
J1 = DAWA-MAIN-7.0:PINHD-2X5: PIN HEADER; MPN: M50-3500542; URL_ALIEXPRESS: https://fr.aliexpress.com/item/32795241952.html
L1 L3 = DAWA-MAIN-7.0:MH2029-300Y: SMD EMI Suppression Ferrite Beads - excellent anti-EMI properties - low DCR - impedances till 3000 ohms - rated current up to 6 A; MPN: MH2029-300Y
L2 = DAWA-MAIN-7.0:SMARTPRJ_L-US: INDUCTOR, American symbol; MPN: SRR0604-100ML
L4 = DAWA-MAIN-7.0:RC-MASTER-SMD_L_: INDUCTOR; MPN: LQG18HN27NJ00D
LED1-LED11 = DAWA-MAIN-7.0:LED: LED OSRAM: - CHIPLED LG R971, LG N971, LY N971, LG Q971, LY Q971, LO R971, LY R971 LH N974, LH R974 LS Q976, LO Q976, LY Q976 LO Q996 - Hyper CHIPLED LW Q18S LB Q993, LB Q99A, LB R99A - SideLED LS A670, LO A670, LY A670, LG A670, LP A670 LB A673, LV A673, LT A673, LW A673 LH A674 LY A675 LS A676, LA A676, LO A676, LY A676, LW A676 LS A679, LY A679, LG A679 - Hyper Micro SIDELED® LS Y876, LA Y876, LO Y876, LY Y876 LT Y87S - SmartLED LW L88C, LW L88S LB L89C, LB L89S, LG L890 LS L89K, LO L89K, LY L89K LS L896, LA L896, LO L896, LY L896 - TOPLED LS T670, LO T670, LY T670, LG T670, LP T670 LSG T670, LSP T670, LSY T670, LOP T670, LYG T670 LG T671, LOG T671, LSG T671 LB T673, LV T673, LT T673, LW T673 LH T674 LS T676, LA T676, LO T676, LY T676, LB T676, LH T676, LSB T676, LW T676 LB T67C, LV T67C, LT T67C, LS T67K, LO T67K, LY T67K, LW E67C LS E67B, LA E67B, LO E67B, LY E67B, LB E67C, LV E67C, LT E67C LW T67C LS T679, LY T679, LG T679 LS T770, LO T770, LY T770, LG T770, LP T770 LB T773, LV T773, LT T773, LW T773 LH T774 LS E675, LA E675, LY E675, LS T675 LS T776, LA T776, LO T776, LY T776, LB T776 LHGB T686 LT T68C, LB T68C - Hyper Mini TOPLED® LB M676 - Mini TOPLED Santana® LG M470 LS M47K, LO M47K, LY M47K Source: http://www.osram.convergy.de LUXEON: - LUMILED® LXK2-PW12-R00, LXK2-PW12-S00, LXK2-PW14-U00, LXK2-PW14-V00 LXK2-PM12-R00, LXK2-PM12-S00, LXK2-PM14-U00 LXK2-PE12-Q00, LXK2-PE12-R00, LXK2-PE12-S00, LXK2-PE14-T00, LXK2-PE14-U00 LXK2-PB12-K00, LXK2-PB12-L00, LXK2-PB12-M00, LXK2-PB14-N00, LXK2-PB14-P00, LXK2-PB14-Q00 LXK2-PR12-L00, LXK2-PR12-M00, LXK2-PR14-Q00, LXK2-PR14-R00 LXK2-PD12-Q00, LXK2-PD12-R00, LXK2-PD12-S00 LXK2-PH12-R00, LXK2-PH12-S00 LXK2-PL12-P00, LXK2-PL12-Q00, LXK2-PL12-R00 Source: www.luxeon.com KINGBRIGHT: KA-3528ASYC Source: www.kingbright.com; MPN: 150060VS55040
Q1 = DAWA-MAIN-7.0:SI2369DS-T1-GE3: MOSFET -30V 29mOhm@-10V -7.6A P-CH; MPN: SI2369DS-T1-GE3
Q2 = DAWA-MAIN-7.0:BSS123: N-CHANNEL MOS FET; MPN: BSS123
Q3 = DAWA-MAIN-7.0:FDN340P: MOS FET; MPN: FDN340P
R1 R7 R10 R14 R15 R27 R41-R44 = DAWA-MAIN-7.0:R-EU-*-?: RESISTOR, European symbol; MPN: CRCW060310K0FKEA
R2 R3 R6 R9 R30 R31 = DAWA-MAIN-7.0:R-EU-*-?: RESISTOR, European symbol; MPN: CRCW0603100KFKEAC
R4 = DAWA-MAIN-7.0:R-EU-*-?: RESISTOR, European symbol; MPN: CRCW060352K3FKEA
R5 = DAWA-MAIN-7.0:R-EU-*-?: RESISTOR, European symbol; MPN: CRCW0603330RFKEAC
R8 = DAWA-MAIN-7.0:R-EU-*-?: RESISTOR, European symbol; MPN: CRCW06031M00FKEC
R11 R12 R16 R17 R19 R20 = DAWA-MAIN-7.0:R-EU-*-?: RESISTOR, European symbol; MPN: CRCW06034K70FKEA
R13 = DAWA-MAIN-7.0:R-EU-*-?: RESISTOR, European symbol; MPN: CRCW060310R0FKEAC
R18 = DAWA-MAIN-7.0:R-EU-*-?: RESISTOR, European symbol; MPN: CRCW0603200KFKEAC
R21 R22 = DAWA-MAIN-7.0:R-EU-*-?: RESISTOR, European symbol; MPN: CRCW06031K80FKEA
R23-R26 R32 R34 R37 R38 = DAWA-MAIN-7.0:R-EU-*-?: RESISTOR, European symbol; MPN: CRCW06031K00FKEA
R28 R29 R33 R39 R40 = DAWA-MAIN-7.0:R-EU-*-?: RESISTOR, European symbol; MPN: CRCW0603100RFKEAC
R35 R36 = DAWA-MAIN-7.0:R-EU-*-?: RESISTOR, European symbol; MPN: CRCW0603510RJNEAHP
RN1 RN2 = DAWA-MAIN-7.0:742-8-*: CTS 742 Series 8 Terminations, 4 Resistors; MPN: 742C083101JP
RN3 = DAWA-MAIN-7.0:742-8-*: CTS 742 Series 8 Terminations, 4 Resistors; MPN: 742C083511JP
S1 = DAWA-MAIN-7.0:MF-*-?: PTC Resettable Fuses; MPN: MF-NSMF050-2
S2 = DAWA-MAIN-7.0:MF-*-?: PTC Resettable Fuses; MPN: MF-MSMF050-2
S3 = DAWA-MAIN-7.0:SKPMAPE10; MPN: SKPMAPE010; URL_ALIEXPRESS: https://fr.aliexpress.com/item/32704068968.html
SJ1 = DAWA-MAIN-7.0:SJ: SMD solder JUMPER
T1 T2 = DAWA-MAIN-7.0:*-NPN-: NPN Transistror BF959 corrected 2008.03.06; MPN: MMBT2222ALT1G
U1 = DAWA-MAIN-7.0:PRTR5V0U2X: I2C-Bus EDS Protection Ulta low capacitance double rail-to-rail ESD protection diode Documentation Datasheet <http://www.nxp.com/documents/data_sheet/PRTR5V0U2X.pdf> General Description Ultra low capacitance rail-to-rail ElectroStatic Discharge (ESD) protection diode in a small SOT143B Surface-Mounted Device (SMD) plastic package designed to protect two Hi-Speed data lines or high-frequency signal lines from the damage caused by ESD and other transients. PRTR5V0U2X incorporates two pairs of ultra low capacitance rail-to-rail diodes as well as an additional ESD protection diode to ensure signal line protection even if no supply voltage is available. Features ESD protection of two Hi-Speed data lines or high-frequency signal lines Ultra low input/output to ground capacitance: C(I/O-GND) = 1 pF ESD protection up to 8kV IEC 61000-4-2, level 4 (ESD) Very low clamping voltage due to an integrated additional ESD protection diode Very low reverse current Small SMD plastic package Applications USB 2.0 ports Digital Video Interface (DVI)/High Definition Multimedia Interface (HDMI) interfaces Mobile and cordless phones Personal Digital Assistants (PDA) Digital Cameras Wide Area Network (WAN) / Local Area Network (LAN) systems PCs, notebooks, printers, and other PC peripherals; MPN: PRTR5V0U2X,215
U2 = DAWA-MAIN-7.0:LM2734Y; MPN: LM2734YMK/NOPB
U3 = DAWA-MAIN-7.0:ATSAMD21G: Atmel SAMD21G SMART ARM-Based Microcontroller The Atmel ® | SMART ™ SAM D21 is a series of low-power microcontrollers using the 32-bit ARM ® Cortex ® -M0+ processor, and ranging from 32- to 64-pins with up to 256KB Flash and 32KB of SRAM. The SAM D21 devices operate at a maximum frequency of 48MHz and reach 2.46 CoreMark/MHz. They are designed for simple and intuitive migration with identical peripheral modules, hex compatible code, identical linear address map and pin compatible migration paths between all devices in the product series. All devices include intelligent and flexible peripherals, Atmel Event System for inter-peripheral signaling, and support for capacitive touch button, slider and wheel user interfaces. Datasheet <https://cdn.sparkfun.com/datasheets/Dev/Arduino/Boards/Atmel-42181-SAM-D21_Datasheet.pdf> SparkFun Products SparkFun SAMD21 Mini Breakout <https://www.sparkfun.com/products/13664> (DEV-13664) SparkFun SAMD21 Dev Breakout <https://www.sparkfun.com/products/13672> (DEV-13672) (DEV-14926); MPN: ATSAMD21G18A-MFT
U4 = DAWA-MAIN-7.0:NEO-M8: u-blox NEO GNSS module; MPN: NEO-M8N-0; URL_ALIEXPRESS: https://fr.aliexpress.com/item/1005001789425115.html
U5 = DAWA-MAIN-7.0:74AHC1G125: TRI-STATE SINGLE BUSS BUFFER; MPN: 74AHC1G125GW,125
U6 = DAWA-MAIN-7.0:MCP23017: http://ww1.microchip.com/downloads/en/DeviceDoc/21952a.pdf Source: http://ww1.microchip.com/downloads/en/DeviceDoc/21952a.pdf; MPN: MCP23017-E/SS
U7 = DAWA-MAIN-7.0:24AA02E48: Serial EEPROM 128 bit, I2C (AA = 1.8 V/LC = 2.5 V/C = 5.0 V); MPN: 24AA02E48T-I/OT
U8 U11 = DAWA-MAIN-7.0:TLV2374IPWR: OPERATIONAL AMPLIFIERS; MPN: TLV2374IPWR
U9 = DAWA-MAIN-7.0:ADC128D818; MPN: ADC128D818CIMTX/NOPB; URL_ALIEXPRESS: https://fr.aliexpress.com/item/32844743544.html
U10 = DAWA-MAIN-7.0:PCA9306DCUT: VOLTAGE-LEVEL TRANSLATOR; MPN: PCA9306DCUT
U12 U13 = DAWA-MAIN-7.0:SN74LVC2G17DBVR: DUAL SCHMITT-TRIGGER BUFFER; MPN: SN74LVC2G17DBVR; URL_ALIEXPRESS: https://fr.aliexpress.com/item/32955292314.html
U14 = DAWA-MAIN-7.0:P82B96D: DUAL BIDIRECTIONAL BUS BUFFER; MPN: P82B96DR
U15 = DAWA-MAIN-7.0:STN2100: Multiprotocol OBD II to UART Interpreter, QFN Package This part, the STN2100, is a preprogrammed pic from ScanTool. Contact: vit@scantool.net
U16 = DAWA-MAIN-7.0:MCP2562T-E-MF: 1/1 Transceiver Half CANbus 8-DFN (3x3); MPN: MCP2562T-E/MF
U17 = DAWA-MAIN-7.0:TL331IDBVR: Single differential Comparator; MPN: TL331KDBVRG4
X1 = DAWA-MAIN-7.0:USB: USB Connectors USBMINIB - Surface Mount Female Mini-B USB Connector 4UConnector: 06564 By microbuilder.eu Thru-hole RA Female Mini-B USB Connector 4UConnector: 18732 By ladyada.net; MPN: 1050170001; URL_ALIEXPRESS: https://fr.aliexpress.com/item/32694652292.html
X2 = DAWA-MAIN-7.0:SMACONNECTOR: SMA Connector 90° DIP SMA Connector, 50 Ohm (4UConnector: 07259); MPN: CON-SMA-EDGE-S; URL_ALIEXPRESS: https://fr.aliexpress.com/item/32779564868.html
X3 = DAWA-MAIN-7.0:DM3AT-SF-PEJM5: CONN MICRO SD R/A PUSH-PUSH SMD; MPN: DM3AT-SF-PEJM5; URL_ALIEXPRESS: https://fr.aliexpress.com/item/32239137511.html
X4 = DAWA-MAIN-7.0:52745-2090: FFC/FPC-to-Board 0.50mm (.020p) SMT Top Contact Right Angle, ZIF, Style Receptacle 52745 / 52435 Source: http://www.molex.com/product/ffc/52745.html; MPN: 687120149022; URL_ALIEXPRESS: https://fr.aliexpress.com/item/32682461090.html
X5 X7-X9 = DAWA-MAIN-7.0:HEADER_POS6_?: Molex - Micro-Fit 3.0 Series connector, 3.00mm (0.118p) pitch header, 6 positions.; MPN: 43045-0600; URL_ALIEXPRESS: https://fr.aliexpress.com/item/1005001345828926.html
X6 = DAWA-MAIN-7.0:RJ45; MPN: 0432028816
Y1 = DAWA-MAIN-7.0:CM7V-T1A: CM7V-T1A Tuning Fork Crystal 32.768 kHz; MPN: CM7V-T1A-32.768kHz-9pF-100PPM-TA-QC
Y2 = DAWA-MAIN-7.0:KX: Quartz Crystals (MHz) SMD: KX - Serie Model Size l/w/h [mm] Frequency Range Frequency Stability Temp. Range [°C] Load Capacitance AECQ 200 availabel Datasheet KX-4 KX-5 KX-6 KX-7 KX-9A KX-9B KX-12A KX-12B KX-13 KX-20 KX-K KX-KS 1.6/1.2/0.3 2.0/1.6/0.45 2.5/2.0/0.55 3.2/2.5/0.8 5.0/3.2/1.0 5.0/3.2/1.1 6.0/3.5/1.1 6.0/3.5/1.0 7.0/5.0 /1.3 11.6/5.5/1.6 12.3/4.5/4.2 12.3/4.5/3.2 24.0 ~ 80.0 MHz 16.0 ~ 80.0 MHz 12.0 ~ 80.0 MHz 8.0 ~ 60.0 MHz 7,68 ~ 300,0 MHz 8,0 ~ 50,0 MHz 8,0 ~ 150,0 MHz 8,0 ~ 50,0 MHz 6,0 ~ 160,0 MHz 3,579 ~ 25,0 MHz 3,579 ~ 70,0 MHz 3,579 ~ 70,0 MHz ±10 … ±50ppm ±10 … ±50ppm ±10 … ±50ppm ±10 … ±50ppm ±10 … ±50ppm ±10 … ±50ppm ±10 … ±50ppm ±10 … ±50ppm ±10 … ±50ppm ±50ppm ±10 … ±50ppm ±10 … ±50ppm (*) -40°C …+85°C (*) -40°C …+125°C (*) -40°C …+125°C (*) -40°C …+125°C (*) -40°C …+105°C (*) -40°C …+105°C (*) -40°C …+125°C (*) -40°C …+105°C (*) -40°C …+105°C (*) -40°C …+105°C (*) -40°C …+85°C (*) -40°C …+85°C 8, 8…16 8, 8…16 10, 8…16 12, 7…20 16, 10…20 16, 10…20 16, 10…20 16, 12…20 16, 12…20 16, 12…20 16, 12…30 16, 12…30 - yes yes yes - - - - - - - - KX-4.pdf <http://www.geyer-electronic.de/uploads/tx_userartikelfrequenz/GEYER-KX-4.pdf> KX-5.pdf <http://www.geyer-electronic.de/uploads/tx_userartikelfrequenz/GEYER-KX-5.pdf> KX-6.pdf <http://www.geyer-electronic.de/uploads/tx_userartikelfrequenz/GEYER-KX-6.pdf> KX-7.pdf <http://www.geyer-electronic.de/uploads/tx_userartikelfrequenz/GEYER-KX-7.pdf> KX-9A.pdf <http://www.geyer-electronic.de/uploads/tx_userartikelfrequenz/GEYER-KX-9A.pdf> KX-9B.pdf <http://www.geyer-electronic.de/uploads/tx_userartikelfrequenz/GEYER-KX-9B.pdf> KX-12A.pdf <http://www.geyer-electronic.de/uploads/tx_userartikelfrequenz/GEYER-KX-12A.pdf> KX-12B.pdf <http://www.geyer-electronic.de/uploads/tx_userartikelfrequenz/GEYER-KX-12B.pdf> KX-13.pdf <http://www.geyer-electronic.de/uploads/tx_userartikelfrequenz/GEYER-KX-13.pdf> KX-20.pdf <http://www.geyer-electronic.de/uploads/tx_userartikelfrequenz/GEYER-KX-20.pdf> KX-K.pdf <http://www.geyer-electronic.de/uploads/tx_userartikelfrequenz/GEYER-KX-K.pdf> KX-KS.pdf <http://www.geyer-electronic.de/uploads/tx_userartikelfrequenz/GEYER-KX-KS.pdf> <http://www.geyer-electronic.de/fileadmin/template/img/logo-geyer-electronic.png> Details see: http://www.geyer-electronic.de/Frequenz-Produkte.9.0.html Created 2016-06-07, Hans Locher 2016 (C) Geyer Quartz Technology KX4,KX5,KX6,KX7,KX9A,KX9B,KX12A,KX12B,KX13,KX20,KXK,KXKS;1612;2016;2520;3225;5032;6035;7050;11655;12345;1,6x1,2;2,0x1,6;2,5x2,0;3,2x2,5;5,0x3,2;6,0x3,5;7,0x5,0;11,6x5,5;12,3x4,5;12,3x4,5;1.6x1.2;2.0x1.6;2.5x2.0;3.2x2.5;5.0x3.2;6.0x3.5;7.0x5.0;11.6x5.5;12.3x4.5;12.3x4.5;; MPN: TSX-3225 16.0000MF18X-AC3

## Net classes
0 default: width 0.203 mm, drill 0.406 mm, clearance 0.203 mm
3 usbvcc: width 0.203 mm, drill 0.406 mm, clearance 0.203 mm
4 USBpair: width 0.254 mm, drill 0.406 mm, clearance 0.61 mm